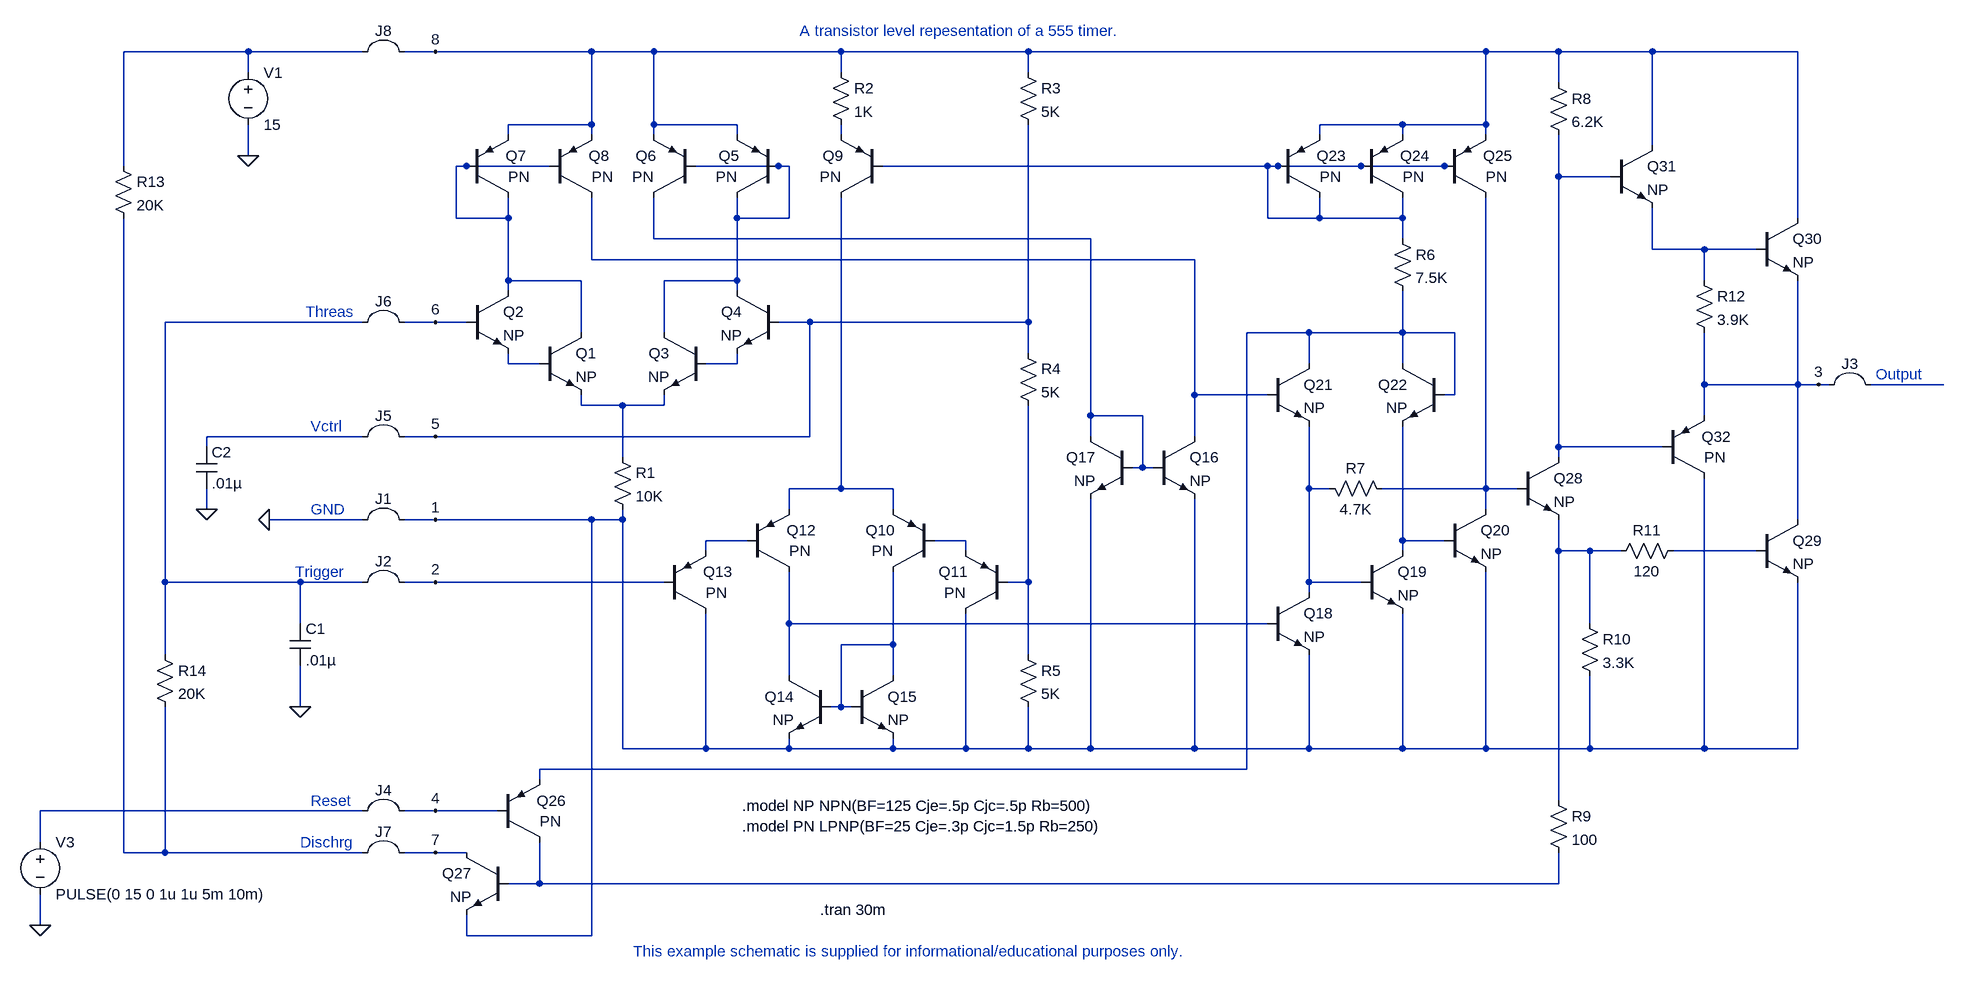
[diagram p0: schematic ne555.asc]
ne555.asc, the LTspice schematic file:
Version 4
SHEET 1 3012 1672
WIRE 400 272 208 272
WIRE 576 272 400 272
WIRE 688 272 640 272
WIRE 928 272 688 272
WIRE 1024 272 928 272
WIRE 1312 272 1024 272
WIRE 1600 272 1312 272
WIRE 2304 272 1600 272
WIRE 2416 272 2304 272
WIRE 2560 272 2416 272
WIRE 2784 272 2560 272
WIRE 400 304 400 272
WIRE 1312 304 1312 272
WIRE 1600 304 1600 272
WIRE 2416 320 2416 272
WIRE 928 384 928 272
WIRE 928 384 800 384
WIRE 1024 384 1024 272
WIRE 1152 384 1024 384
WIRE 2176 384 2048 384
WIRE 2304 384 2304 272
WIRE 2304 384 2176 384
WIRE 800 400 800 384
WIRE 928 400 928 384
WIRE 1024 400 1024 384
WIRE 1152 400 1152 384
WIRE 1312 400 1312 384
WIRE 2048 400 2048 384
WIRE 2176 400 2176 384
WIRE 2304 400 2304 384
WIRE 2560 416 2560 272
WIRE 400 432 400 384
WIRE 208 448 208 272
WIRE 736 448 720 448
WIRE 864 448 736 448
WIRE 1216 448 1088 448
WIRE 1232 448 1216 448
WIRE 1968 448 1376 448
WIRE 1984 448 1968 448
WIRE 2112 448 1984 448
WIRE 2240 448 2112 448
WIRE 2256 448 2240 448
WIRE 2416 464 2416 400
WIRE 2496 464 2416 464
WIRE 720 528 720 448
WIRE 800 528 800 496
WIRE 800 528 720 528
WIRE 1152 528 1152 496
WIRE 1232 528 1232 448
WIRE 1232 528 1152 528
WIRE 1968 528 1968 448
WIRE 2048 528 2048 496
WIRE 2048 528 1968 528
WIRE 2176 528 2176 496
WIRE 2176 528 2048 528
WIRE 2784 528 2784 272
WIRE 1024 560 1024 496
WIRE 1696 560 1024 560
WIRE 2176 560 2176 528
WIRE 2560 576 2560 512
WIRE 2640 576 2560 576
WIRE 2720 576 2640 576
WIRE 928 592 928 496
WIRE 1856 592 928 592
WIRE 800 624 800 528
WIRE 912 624 800 624
WIRE 1152 624 1152 528
WIRE 1152 624 1040 624
WIRE 2640 624 2640 576
WIRE 800 640 800 624
WIRE 1152 640 1152 624
WIRE 576 688 272 688
WIRE 688 688 640 688
WIRE 736 688 688 688
WIRE 1264 688 1216 688
WIRE 1600 688 1600 384
WIRE 1600 688 1264 688
WIRE 912 704 912 624
WIRE 1040 704 1040 624
WIRE 2032 704 1936 704
WIRE 2176 704 2176 640
WIRE 2176 704 2032 704
WIRE 2256 704 2176 704
WIRE 1600 736 1600 688
WIRE 800 752 800 736
WIRE 848 752 800 752
WIRE 1152 752 1152 736
WIRE 1152 752 1104 752
WIRE 2032 752 2032 704
WIRE 2176 752 2176 704
WIRE 2640 784 2640 704
WIRE 2784 784 2784 624
WIRE 2784 784 2640 784
WIRE 2816 784 2784 784
WIRE 2832 784 2816 784
WIRE 3008 784 2896 784
WIRE 1856 800 1856 592
WIRE 1968 800 1856 800
WIRE 2256 800 2256 704
WIRE 2256 800 2240 800
WIRE 912 816 912 800
WIRE 976 816 912 816
WIRE 1040 816 1040 800
WIRE 1040 816 976 816
WIRE 1696 832 1696 560
WIRE 1776 832 1696 832
WIRE 2640 832 2640 784
WIRE 576 864 336 864
WIRE 688 864 640 864
WIRE 1264 864 1264 688
WIRE 1264 864 688 864
WIRE 1696 864 1696 832
WIRE 1856 864 1856 800
WIRE 336 880 336 864
WIRE 2416 880 2416 464
WIRE 2576 880 2416 880
WIRE 976 896 976 816
WIRE 2416 896 2416 880
WIRE 1776 912 1776 832
WIRE 1776 912 1760 912
WIRE 1792 912 1776 912
WIRE 1312 944 1312 496
WIRE 1312 944 1232 944
WIRE 1392 944 1312 944
WIRE 2032 944 2032 848
WIRE 2064 944 2032 944
WIRE 2304 944 2304 496
WIRE 2304 944 2144 944
WIRE 2352 944 2304 944
WIRE 336 976 336 944
WIRE 1232 976 1232 944
WIRE 1392 976 1392 944
WIRE 2304 976 2304 944
WIRE 576 992 432 992
WIRE 688 992 640 992
WIRE 928 992 688 992
WIRE 976 992 976 976
WIRE 976 992 928 992
WIRE 2784 992 2784 784
WIRE 1168 1024 1104 1024
WIRE 1504 1024 1456 1024
WIRE 2176 1024 2176 848
WIRE 2240 1024 2176 1024
WIRE 1104 1040 1104 1024
WIRE 1504 1040 1504 1024
WIRE 2176 1040 2176 1024
WIRE 2416 1040 2416 992
WIRE 2464 1040 2416 1040
WIRE 2512 1040 2464 1040
WIRE 2720 1040 2592 1040
WIRE 272 1088 272 688
WIRE 480 1088 272 1088
WIRE 576 1088 480 1088
WIRE 688 1088 640 1088
WIRE 1040 1088 688 1088
WIRE 1600 1088 1600 816
WIRE 1600 1088 1568 1088
WIRE 2032 1088 2032 944
WIRE 2112 1088 2032 1088
WIRE 2032 1104 2032 1088
WIRE 480 1152 480 1088
WIRE 1232 1152 1232 1072
WIRE 1968 1152 1232 1152
WIRE 2464 1152 2464 1040
WIRE 1392 1184 1392 1072
WIRE 1392 1184 1312 1184
WIRE 272 1200 272 1088
WIRE 1600 1200 1600 1088
WIRE 1232 1232 1232 1152
WIRE 1392 1232 1392 1184
WIRE 480 1280 480 1216
WIRE 1312 1280 1312 1184
WIRE 1312 1280 1296 1280
WIRE 1328 1280 1312 1280
WIRE 976 1344 976 992
WIRE 1104 1344 1104 1136
WIRE 1104 1344 976 1344
WIRE 1232 1344 1232 1328
WIRE 1232 1344 1104 1344
WIRE 1392 1344 1392 1328
WIRE 1392 1344 1232 1344
WIRE 1504 1344 1504 1136
WIRE 1504 1344 1392 1344
WIRE 1600 1344 1600 1280
WIRE 1600 1344 1504 1344
WIRE 1696 1344 1696 960
WIRE 1696 1344 1600 1344
WIRE 1856 1344 1856 960
WIRE 1856 1344 1696 1344
WIRE 2032 1344 2032 1200
WIRE 2032 1344 1856 1344
WIRE 2176 1344 2176 1136
WIRE 2176 1344 2032 1344
WIRE 2304 1344 2304 1072
WIRE 2304 1344 2176 1344
WIRE 2464 1344 2464 1232
WIRE 2464 1344 2304 1344
WIRE 2640 1344 2640 928
WIRE 2640 1344 2464 1344
WIRE 2784 1344 2784 1088
WIRE 2784 1344 2640 1344
WIRE 1936 1376 1936 704
WIRE 1936 1376 848 1376
WIRE 848 1392 848 1376
WIRE 2416 1424 2416 1040
WIRE 576 1440 80 1440
WIRE 688 1440 640 1440
WIRE 784 1440 688 1440
WIRE 80 1488 80 1440
WIRE 208 1504 208 528
WIRE 272 1504 272 1280
WIRE 272 1504 208 1504
WIRE 576 1504 272 1504
WIRE 688 1504 640 1504
WIRE 736 1504 688 1504
WIRE 848 1552 848 1488
WIRE 848 1552 800 1552
WIRE 2416 1552 2416 1504
WIRE 2416 1552 848 1552
WIRE 80 1616 80 1568
WIRE 736 1632 736 1600
WIRE 928 1632 928 992
WIRE 928 1632 736 1632
FLAG 432 992 0
FLAG 688 1504 7
FLAG 688 1440 4
FLAG 688 1088 2
FLAG 688 992 1
FLAG 688 864 5
FLAG 688 688 6
FLAG 688 272 8
FLAG 2816 784 3
FLAG 480 1280 0
FLAG 336 976 0
FLAG 400 432 0
FLAG 80 1616 0
SYMBOL NPN 848 704 R0
SYMATTR InstName Q1
SYMATTR Value NP
SYMBOL npn 736 640 R0
SYMATTR InstName Q2
SYMATTR Value NP
SYMBOL npn 1104 704 M0
SYMATTR InstName Q3
SYMATTR Value NP
SYMBOL npn 1216 640 M0
SYMATTR InstName Q4
SYMATTR Value NP
SYMBOL res 960 880 R0
SYMATTR InstName R1
SYMATTR Value 10K
SYMBOL PNP 1216 496 R180
WINDOW 0 60 64 Left 0
WINDOW 3 64 32 Left 0
SYMATTR InstName Q5
SYMATTR Value PN
SYMBOL pnp 1088 496 R180
WINDOW 0 60 64 Left 0
WINDOW 3 64 32 Left 0
SYMATTR InstName Q6
SYMATTR Value PN
SYMBOL pnp 736 496 M180
WINDOW 0 60 64 Left 0
WINDOW 3 64 32 Left 0
SYMATTR InstName Q7
SYMATTR Value PN
SYMBOL pnp 864 496 M180
WINDOW 0 60 64 Left 0
WINDOW 3 64 32 Left 0
SYMATTR InstName Q8
SYMATTR Value PN
SYMBOL pnp 1376 496 R180
WINDOW 0 60 64 Left 0
WINDOW 3 64 32 Left 0
SYMATTR InstName Q9
SYMATTR Value PN
SYMBOL res 1296 288 R0
SYMATTR InstName R2
SYMATTR Value 1K
SYMBOL pnp 1456 1072 R180
WINDOW 0 60 64 Left 0
WINDOW 3 64 32 Left 0
SYMATTR InstName Q10
SYMATTR Value PN
SYMBOL pnp 1568 1136 R180
WINDOW 0 60 64 Left 0
WINDOW 3 64 32 Left 0
SYMATTR InstName Q11
SYMATTR Value PN
SYMBOL pnp 1168 1072 M180
WINDOW 0 60 64 Left 0
WINDOW 3 64 32 Left 0
SYMATTR InstName Q12
SYMATTR Value PN
SYMBOL pnp 1040 1136 M180
WINDOW 0 60 64 Left 0
WINDOW 3 64 32 Left 0
SYMATTR InstName Q13
SYMATTR Value PN
SYMBOL npn 1296 1232 M0
SYMATTR InstName Q14
SYMATTR Value NP
SYMBOL npn 1328 1232 R0
SYMATTR InstName Q15
SYMATTR Value NP
SYMBOL res 1584 288 R0
SYMATTR InstName R3
SYMATTR Value 5K
SYMBOL res 1584 720 R0
SYMATTR InstName R4
SYMATTR Value 5K
SYMBOL res 1584 1184 R0
SYMATTR InstName R5
SYMATTR Value 5K
SYMBOL npn 1792 864 R0
SYMATTR InstName Q16
SYMATTR Value NP
SYMBOL npn 1760 864 M0
SYMATTR InstName Q17
SYMATTR Value NP
SYMBOL npn 1968 1104 R0
SYMATTR InstName Q18
SYMATTR Value NP
SYMBOL npn 2112 1040 R0
SYMATTR InstName Q19
SYMATTR Value NP
SYMBOL npn 2240 976 R0
SYMATTR InstName Q20
SYMATTR Value NP
SYMBOL npn 1968 752 R0
SYMATTR InstName Q21
SYMATTR Value NP
SYMBOL npn 2240 752 M0
SYMATTR InstName Q22
SYMATTR Value NP
SYMBOL pnp 1984 496 M180
WINDOW 0 60 64 Left 0
WINDOW 3 64 32 Left 0
SYMATTR InstName Q23
SYMATTR Value PN
SYMBOL pnp 2112 496 M180
WINDOW 0 60 64 Left 0
WINDOW 3 64 32 Left 0
SYMATTR InstName Q24
SYMATTR Value PN
SYMBOL pnp 2240 496 M180
WINDOW 0 60 64 Left 0
WINDOW 3 64 32 Left 0
SYMATTR InstName Q25
SYMATTR Value PN
SYMBOL res 2160 544 R0
SYMATTR InstName R6
SYMATTR Value 7.5K
SYMBOL res 2160 960 M270
WINDOW 0 32 56 VTop 0
WINDOW 3 0 56 VBottom 0
SYMATTR InstName R7
SYMATTR Value 4.7K
SYMBOL pnp 784 1488 M180
WINDOW 0 60 64 Left 0
WINDOW 3 64 32 Left 0
SYMATTR InstName Q26
SYMATTR Value PN
SYMBOL npn 800 1504 M0
SYMATTR InstName Q27
SYMATTR Value NP
SYMBOL npn 2352 896 R0
SYMATTR InstName Q28
SYMATTR Value NP
SYMBOL res 2400 304 R0
SYMATTR InstName R8
SYMATTR Value 6.2K
SYMBOL res 2400 1408 R0
SYMATTR InstName R9
SYMATTR Value 100
SYMBOL res 2448 1136 R0
SYMATTR InstName R10
SYMATTR Value 3.3K
SYMBOL res 2608 1024 R90
WINDOW 0 0 56 VBottom 0
WINDOW 3 32 56 VTop 0
SYMATTR InstName R11
SYMATTR Value 120
SYMBOL npn 2720 992 R0
SYMATTR InstName Q29
SYMATTR Value NP
SYMBOL npn 2720 528 R0
SYMATTR InstName Q30
SYMATTR Value NP
SYMBOL npn 2496 416 R0
SYMATTR InstName Q31
SYMATTR Value NP
SYMBOL res 2624 608 R0
SYMATTR InstName R12
SYMATTR Value 3.9K
SYMBOL pnp 2576 928 M180
WINDOW 0 60 64 Left 0
WINDOW 3 64 32 Left 0
SYMATTR InstName Q32
SYMATTR Value PN
SYMBOL MISC\\JUMPER 608 208 R0
SYMATTR InstName J8
SYMBOL misc\\jumper 608 624 R0
SYMATTR InstName J6
SYMBOL misc\\jumper 608 800 R0
SYMATTR InstName J5
SYMBOL misc\\jumper 608 928 R0
SYMATTR InstName J1
SYMBOL misc\\jumper 608 1024 R0
SYMATTR InstName J2
SYMBOL misc\\jumper 608 1376 R0
SYMATTR InstName J4
SYMBOL misc\\jumper 608 1440 R0
SYMATTR InstName J7
SYMBOL misc\\jumper 2864 720 R0
SYMATTR InstName J3
SYMBOL cap 320 880 R0
SYMATTR InstName C2
SYMATTR Value .01µ
SYMBOL cap 464 1152 R0
SYMATTR InstName C1
SYMATTR Value .01µ
SYMBOL res 192 432 R0
SYMATTR InstName R13
SYMATTR Value 20K
SYMBOL res 256 1184 R0
SYMATTR InstName R14
SYMATTR Value 20K
SYMBOL voltage 80 1472 R0
SYMATTR InstName V3
SYMATTR Value PULSE(0 15 0 1u 1u 5m 10m)
SYMBOL voltage 400 288 R0
SYMATTR InstName V1
SYMATTR Value 15
TEXT 472 1072 Left 0 ;Trigger
TEXT 496 976 Left 0 ;GND
TEXT 496 848 Left 0 ;Vctrl
TEXT 488 672 Left 0 ;Threas
TEXT 496 1424 Left 0 ;Reset
TEXT 480 1488 Left 0 ;Dischrg
TEXT 2904 768 Left 0 ;Output
TEXT 1160 1432 Left 0 !.model NP NPN(BF=125 Cje=.5p Cjc=.5p Rb=500)\n.model PN LPNP(BF=25 Cje=.3p Cjc=1.5p Rb=250)
TEXT 1280 1592 Left 0 !.tran 30m
TEXT 992 1656 Left 0 ;This example schematic is supplied for informational/educational purposes only.
TEXT 1248 240 Left 0 ;A transistor level repesentation of a 555 timer.

The netlist it stands for:
* ne555.asc
Q1 N002 N010 N012 0 NP
Q2 N002 6 N010 0 NP
Q3 N003 N011 N012 0 NP
Q4 N003 5 N011 0 NP
R1 N012 0 10K
Q5 N003 N003 8 0 PN
Q6 N006 N003 8 0 PN
Q7 N002 N002 8 0 PN
Q8 N008 N002 8 0 PN
Q9 N013 N004 N001 0 PN
R2 8 N001 1K
Q10 N023 N017 N013 0 PN
Q11 0 N021 N017 0 PN
Q12 N022 N016 N013 0 PN
Q13 0 6 N016 0 PN
Q14 N022 N023 0 0 NP
Q15 N023 N023 0 0 NP
R3 8 5 5K
R4 5 N021 5K
R5 N021 0 5K
Q16 N008 N006 0 0 NP
Q17 N006 N006 0 0 NP
Q18 N014 N022 0 0 NP
Q19 N018 N014 0 0 NP
Q20 N015 N018 0 0 NP
Q21 N009 N008 N014 0 NP
Q22 N009 N009 N018 0 NP
Q23 N004 N004 8 0 PN
Q24 N004 N004 8 0 PN
Q25 N015 N004 8 0 PN
R6 N004 N009 7.5K
R7 N015 N014 4.7K
Q26 N024 4 N009 0 PN
Q27 7 N024 0 0 NP
Q28 N005 N015 N019 0 NP
R8 8 N005 6.2K
R9 N019 N024 100
R10 N019 0 3.3K
R11 N020 N019 120
Q29 3 N020 0 0 NP
Q30 8 N007 3 0 NP
Q31 8 N005 N007 0 NP
R12 N007 3 3.9K
Q32 0 N005 3 0 PN
C2 5 0 .01µ
C1 6 0 .01µ
R13 8 7 20K
R14 6 7 20K
V3 4 0 PULSE(0 15 0 1u 1u 5m 10m)
V1 8 0 15
.model NPN NPN
.model PNP PNP
.lib standard.bjt
* Trigger
* GND
* Vctrl
* Threas
* Reset
* Dischrg
* Output
.model NP NPN(BF=125 Cje=.5p Cjc=.5p Rb=500)
.model PN LPNP(BF=25 Cje=.3p Cjc=1.5p Rb=250)
.tran 30m
* This example schematic is supplied for informational/educational purposes only.
* A transistor level repesentation of a 555 timer.
.backanno
.end